# Altium schematic sheet imgInteriorR.SchDoc
size A
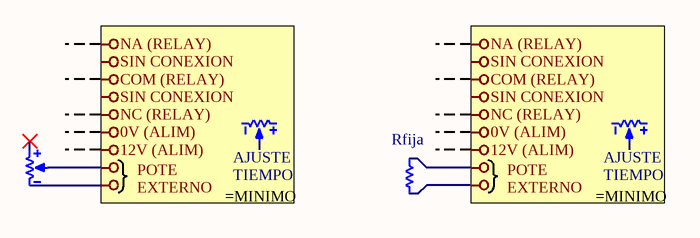
[diagram p0: imgInteriorR.SchDoc]

## Parts
(Parts that share a designator on the sheet are numbered #1, #2 ... from top to bottom, then left to right.)
R?#1  Set Position: AJUSTE  [conpol4x1]  (hidden comment: RVar)  (part A of 2)
R?#2  Set Position: AJUSTE  [conpol4x1]  (hidden comment: RVar)  (part A of 2)
R?#3  Preset  [PRESET6]  (value not drawn)
Rfija  Resistencia 1Kohm 10W  [R_10W]  (value not drawn)

## Nets
NetR?#3_2: R?#3.2 R?#3.3 Rfija.1 Rfija.2

Not connected (* = marked no-connect by the designer): R?#1 1 2 3; R?#2 1 2 3; R?#3 1*

## Notes on the sheet
- (near R?#1) POTE EXTERNO
- (near R?#2) POTE EXTERNO
- Labels drawn without touching a wire or pin: 0V (ALIM), 12V (ALIM), COM (RELAY), NA (RELAY), NC (RELAY), SIN CONEXION
- (in symbol RVar, part A) TIEMPO

## Library data of the parts
R?#1 R?#2 = RVar: Resistencia Variable
R?#3 = Preset: Resistencia Variable; Value: 1K
Rfija = Resistencia 1Kohm 10W: Codigo Elemon: RS3886185; Dolares Elemon: 0.00720; Resistencia: 1K